# Altium schematic sheet HamsterBear_Core_Board.SchDoc
size A3
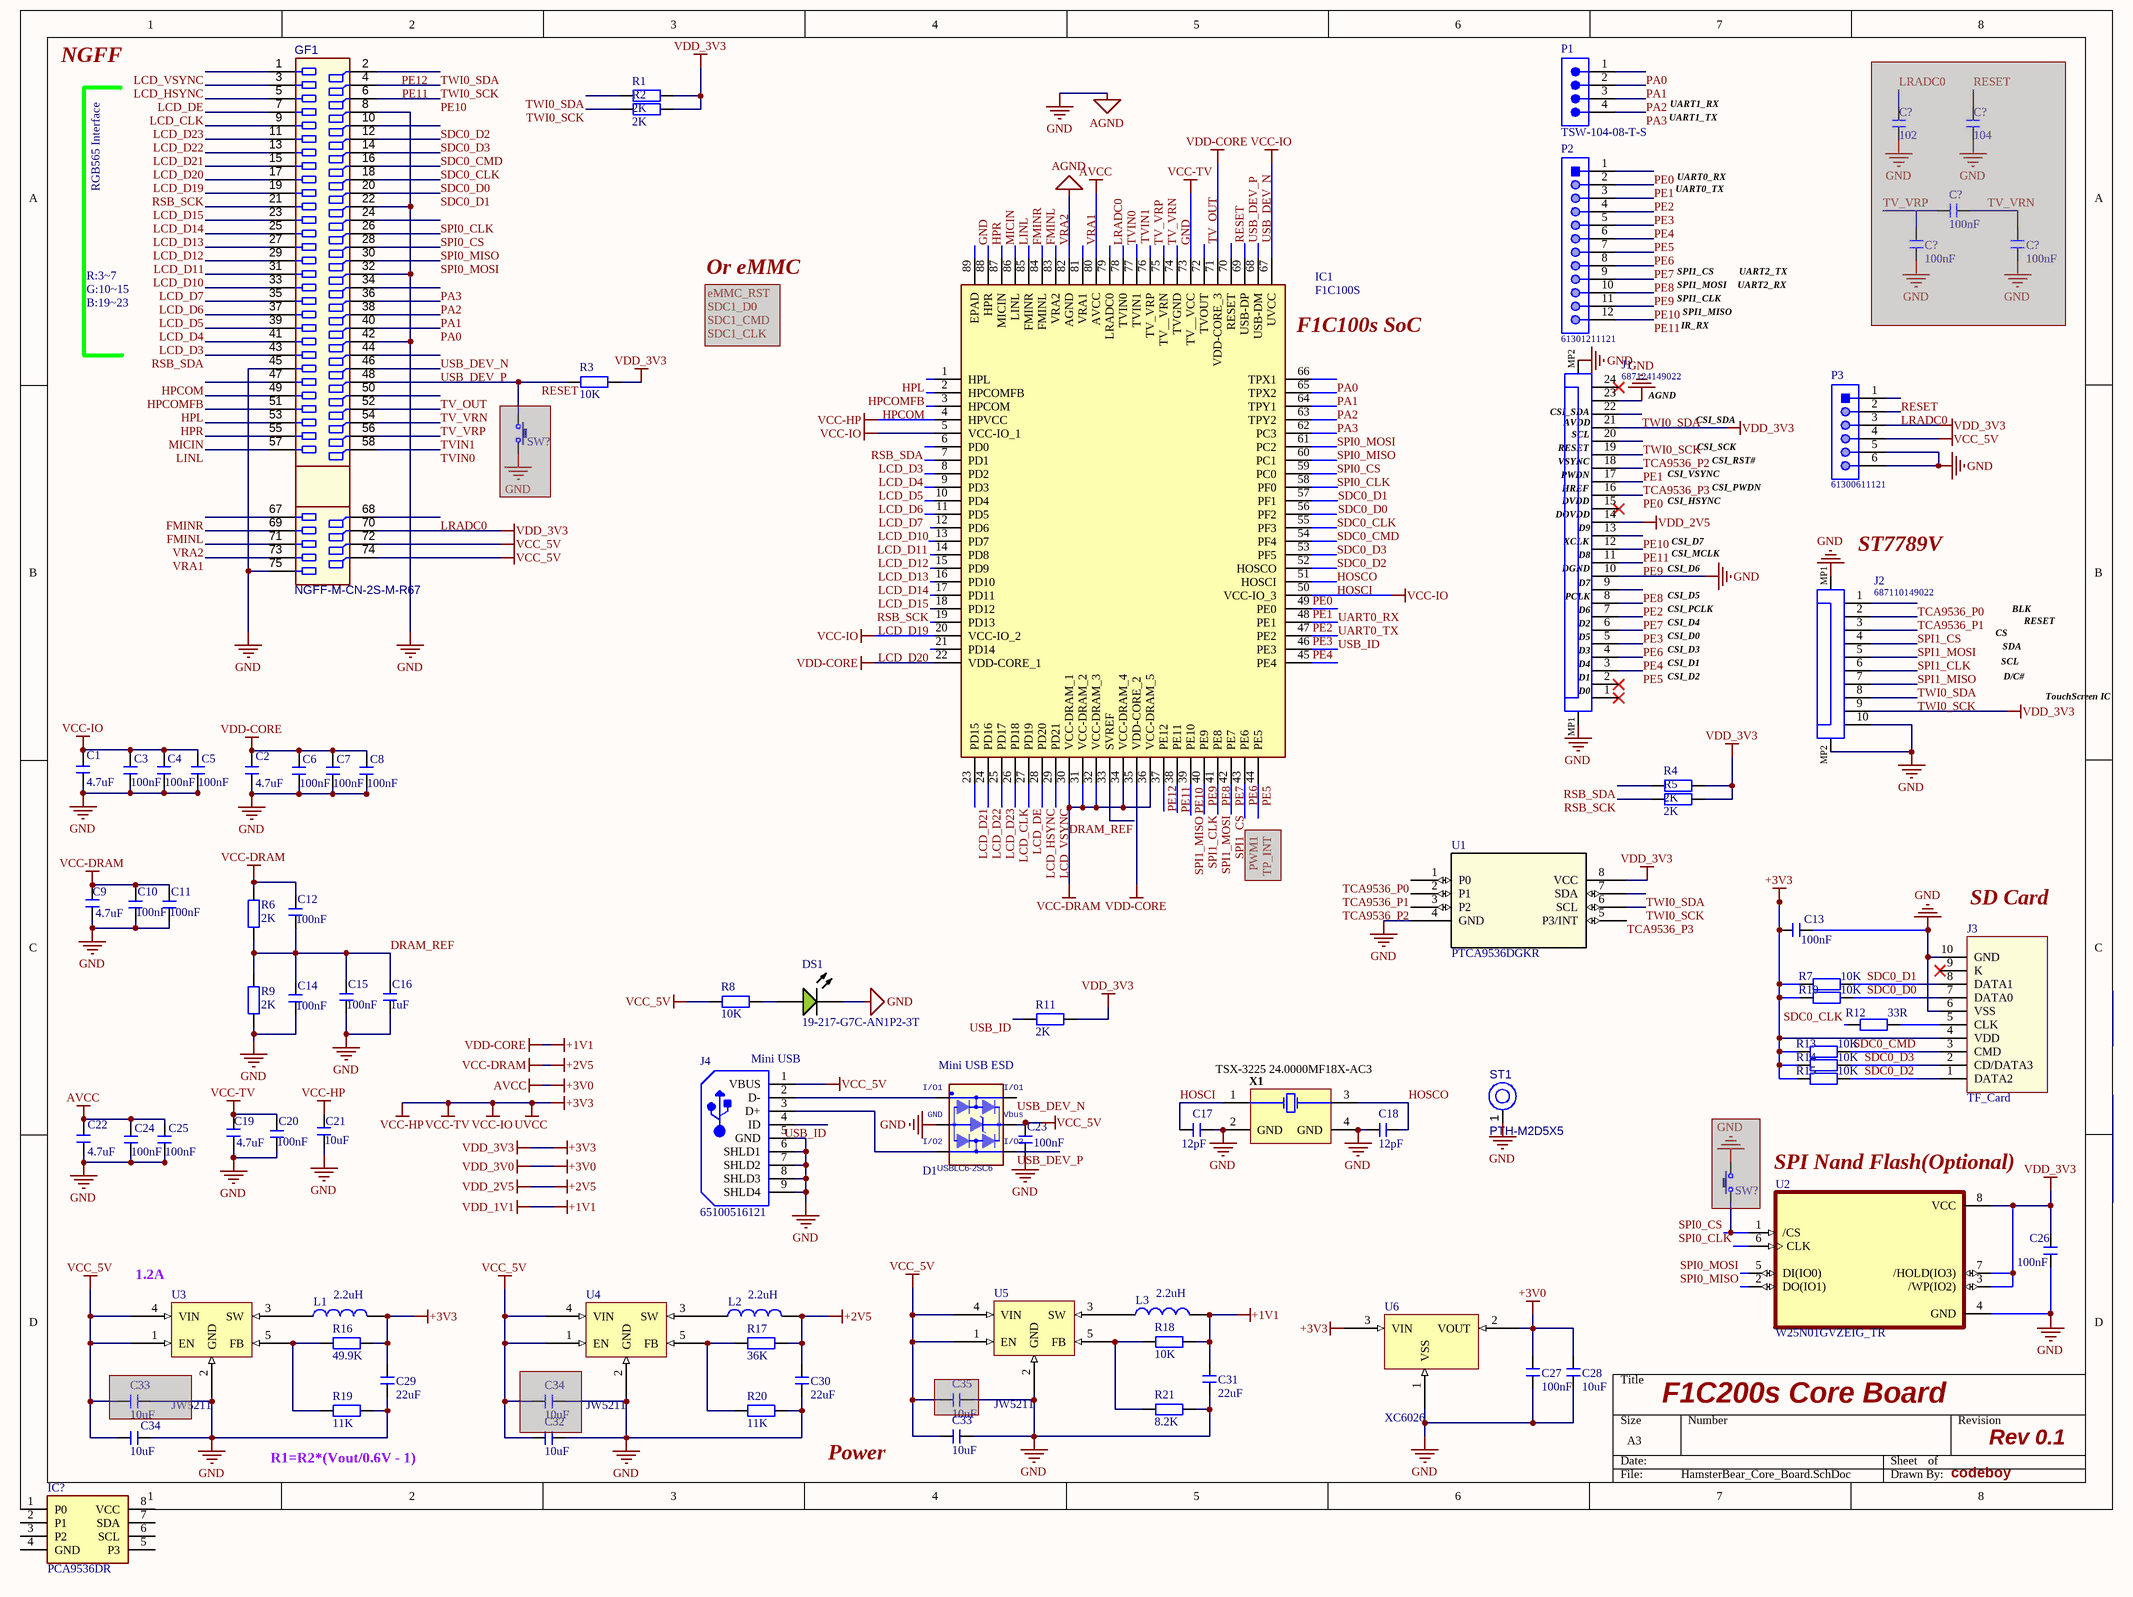
[diagram p0: HamsterBear_Core_Board.SchDoc]

## Parts
(Parts that share a designator on the sheet are numbered #1, #2 ... from top to bottom, then left to right.)
C1  4.7uF  [0603_C]
C2  4.7uF  [0603_C]
C3  100nF  [0603_C]
C4  100nF  [0603_C]
C5  100nF  [0603_C]
C6  100nF  [0603_C]
C7  100nF  [0603_C]
C8  100nF  [0603_C]
C9  4.7uF  [0603_C]
C10  100nF  [0603_C]
C11  100nF  [0603_C]
C12  100nF  [0603_C]
C13  100nF  [0603_C]
C14  100nF  [0603_C]
C15  100nF  [0603_C]
C16  1uF  [0603_C]
C17  12pF  [0603_C]
C18  12pF  [0603_C]
C19  4.7uF  [0603_C]
C20  100nF  [0603_C]
C21  10uF  [0603_C]
C22  4.7uF  [0603_C]
C23  100nF  [0603_C]
C24  100nF  [0603_C]
C25  100nF  [0603_C]
C26  100nF  [0603_C]
C27  100nF  [0603_C]
C28  10uF  [0603_C]
C29  22uF  [0603_C]
C30  22uF  [0603_C]
C31  22uF  [0603_C]
C32  10uF  [0603_C]
C33#1  10uF  [0603_C]  (masked out: inside a compile mask, not in the netlist)
C33#2  10uF  [0603_C]
C34#1  10uF  [0603_C]  (masked out: inside a compile mask, not in the netlist)
C34#2  10uF  [0603_C]
C35  10uF  [0603_C]  (masked out: inside a compile mask, not in the netlist)
C?#1  102  [0603_C]  (masked out: inside a compile mask, not in the netlist)
C?#2  104  [0603_C]  (masked out: inside a compile mask, not in the netlist)
C?#3  100nF  [0603_C]  (masked out: inside a compile mask, not in the netlist)
C?#4  100nF  [0603_C]  (masked out: inside a compile mask, not in the netlist)
C?#5  100nF  [0603_C]  (masked out: inside a compile mask, not in the netlist)
D1  USBLC6-2SC6  [ST_SOT23-6L]
DS1  19-217-G7C-AN1P2-3T  [EVRL-0603-2_V]
GF1  NGFF-M-CN-2S-M-R67  [NGFF-M-GF-2D-500-1K-S67]  (no BOM)
IC1  F1C100S  [QFN40P1000X1000X90_HS-89N]
IC?  PCA9536DR  [SOIC127P600X175-8N]
J1  687124149022  [687124149022]
J2  687110149022  [687110149022]
J3  TF_Card  [TF-SMD_TF-01A]
J4  65100516121  [WE-65100516121_V]
L1  2.2uH  [0805_L]
L2  2.2uH  [0805_L]
L3  2.2uH  [0805_L]
P1  TSW-104-08-T-S  [SMTC-TSW-104-08-X-S]
P2  61301211121  [61301211121]
P3  61300611121  [61300611121]
R1  2K  [0603_R]
R2  2K  [0603_R]
R3  10K  [0603_R]
R4  2K  [0603_R]
R5  2K  [0603_R]
R6  2K  [0603_R]
R7  10K  [0603_R]
R8  10K  [0603_R]
R9  2K  [0603_R]
R10  10K  [0603_R]
R11  2K  [0603_R]
R12  33R  [0603_R]
R13  10K  [0603_R]
R14  10K  [0603_R]
R15  10K  [0603_R]
R16  49.9K  [0603_R]
R17  36K  [0603_R]
R18  10K  [0603_R]
R19  11K  [0603_R]
R20  11K  [0603_R]
R21  8.2K  [0603_R]
ST1  PTH-M2D5X5  [PTH-M2D5X5]
SW?#1  3x4  (value not drawn)  (masked out: inside a compile mask, not in the netlist)
SW?#2  3x4  (value not drawn)  (masked out: inside a compile mask, not in the netlist)
U1  PTCA9536DGKR  [U_VSSOP_DGK_TEX]
U2  W25N01GVZEIG_TR  [WSON8_8x6mm]
U3  JW5211  [SOT-23-5]
U4  JW5211  [SOT-23-5]
U5  JW5211  [SOT-23-5]
U6  XC6026  [SOT95P290X120-3N]
X1  TSX-3225 24.0000MF18X-AC3  [EPSON-TSX-3225_V]

## Nets
+1V1: C2.2 C6.2 C7.2 C8.2 C31.2 IC1.22(VDD-CORE_1) IC1.35(VDD-CORE_2) IC1.71(VDD-CORE_3) L3.2 R18.1  [also labelled VDD-CORE, VDD_1V1]
+2V5: C9.2 C10.2 C11.2 C12.2 C30.2 IC1.30(VCC-DRAM_1) IC1.31(VCC-DRAM_2) IC1.32(VCC-DRAM_3) IC1.34(VCC-DRAM_4) IC1.36(VCC-DRAM_5) J1.14 L2.2 R6.2 R17.1  [also labelled VCC-DRAM, VDD_2V5]
+3V0: C22.2 C24.2 C25.2 C27.1 C28.1 IC1.80(AVCC) U6.2(VOUT)  [also labelled AVCC, VDD_3V0]
+3V3: C1.2 C3.2 C4.2 C5.2 C13.1 C19.2 C20.2 C21.2 C26.2 C29.2 GF1.70 IC1.4(HPVCC) IC1.5(VCC-IO_1) IC1.20(VCC-IO_2) IC1.50(VCC-IO_3) IC1.67(UVCC) IC1.73(TV__VCC) J1.21 J2.9 J3.4(VDD) L1.2 P3.3 R1.2 R2.2 R3.1 R4.2 R5.2 R7.1 R10.1 R11.2 R13.1 R14.1 R15.1 R16.1 U1.8(VCC) U2.3(/WP(IO2)) U2.7(/HOLD(IO3)) U2.8(VCC) U6.3(VIN)  [also labelled UVCC, VCC-HP, VCC-IO, VCC-TV, VDD_3V3]
GND: C1.1 C2.1 C3.1 C4.1 C5.1 C6.1 C7.1 C8.1 C9.1 C10.1 C11.1 C13.2 C14.1 C15.1 C16.1 C17.1 C18.2 C19.1 C20.1 C21.1 C22.1 C23.1 C24.1 C25.1 C26.1 C27.2 C28.2 C29.1 C30.1 C31.1 C32.2 C33#2.2 C34#2.2 D1.2(GND) DS1.2(K) GF1.8 GF1.22 GF1.32 GF1.42 GF1.45 GF1.75 IC1.74(TVGND) IC1.82(AGND) IC1.89(EPAD) J1.10 J1.23 J1.MP1 J1.MP2 J2.10 J2.MP1 J2.MP2 J3.6(VSS) J3.10(GND) J4.5(GND) J4.6(SHLD1) J4.7(SHLD2) J4.8(SHLD3) J4.9(SHLD4) P3.5 P3.6 R9.2 R19.1 R20.1 R21.1 ST1.1(H1) U1.4(GND) U2.4(GND) U3.2(GND) U4.2(GND) U5.2(GND) U6.1(VSS) X1.2(GND) X1.4(GND)  [also labelled AGND]
VCC_5V: C23.2 C32.1 C33#2.1 C34#2.1 D1.5(Vbus) GF1.72 GF1.74 J4.1(VBUS) P3.4 R8.2 U3.1(EN) U3.4(VIN) U4.1(EN) U4.4(VIN) U5.1(EN) U5.4(VIN)
DRAM_REF: C12.1 C14.2 C15.2 C16.2 IC1.33(SVREF) R6.1 R9.1
FMINL: GF1.69 IC1.84(FMINL)
FMINR: GF1.67 IC1.85(FMINR)
HOSCI: C17.2 IC1.51(HOSCI) X1.1(X1)
HOSCO: C18.1 IC1.52(HOSCO) X1.3(X2)
HPCOM: GF1.47 IC1.3(HPCOM)
HPCOMFB: GF1.49 IC1.2(HPCOMFB)
HPL: GF1.51 IC1.1(HPL)
HPR: GF1.53 IC1.88(HPR)
LCD_CLK: GF1.7 IC1.26(PD18)
LCD_D3: GF1.41 IC1.7(PD1)
LCD_D4: GF1.39 IC1.8(PD2)
LCD_D5: GF1.37 IC1.9(PD3)
LCD_D6: GF1.35 IC1.10(PD4)
LCD_D7: GF1.33 IC1.11(PD5)
LCD_D10: GF1.31 IC1.12(PD6)
LCD_D11: GF1.29 IC1.13(PD7)
LCD_D12: GF1.27 IC1.14(PD8)
LCD_D13: GF1.25 IC1.15(PD9)
LCD_D14: GF1.23 IC1.16(PD10)
LCD_D15: GF1.21 IC1.17(PD11)
LCD_D19: GF1.17 IC1.19(PD13)
LCD_D20: GF1.15 IC1.21(PD14)
LCD_D21: GF1.13 IC1.23(PD15)
LCD_D22: GF1.11 IC1.24(PD16)
LCD_D23: GF1.9 IC1.25(PD17)
LCD_DE: GF1.5 IC1.27(PD19)
LCD_HSYNC: GF1.3 IC1.28(PD20)
LCD_VSYNC: GF1.1 IC1.29(PD21)
LINL: GF1.57 IC1.86(LINL)
LRADC0: GF1.68 IC1.79(LRADC0) P3.2
MICIN: GF1.55 IC1.87(MICIN)
PA0: GF1.40 IC1.66(TPX1) P1.1
PA1: GF1.38 IC1.65(TPX2) P1.2
PA2: GF1.36 IC1.64(TPY1) P1.3
PA3: GF1.34 IC1.63(TPY2) P1.4
PE0: IC1.49(PE0) J1.16 P2.1  [also labelled UART0_RX]
PE1: IC1.48(PE1) J1.18 P2.2  [also labelled UART0_TX]
PE2: IC1.47(PE2) J1.8 J4.4(ID) P2.3 R11.1  [also labelled USB_ID]
PE3: IC1.46(PE3) J1.6 P2.4
PE4: IC1.45(PE4) J1.4 P2.5
PE5: IC1.44(PE5) J1.3 P2.6
PE6: IC1.43(PE6) J1.5 P2.7
PE7: IC1.42(PE7) J1.7 J2.3 P2.8  [also labelled SPI1_CS]
PE8: IC1.41(PE8) J1.9 J2.4 P2.9  [also labelled SPI1_MOSI]
PE9: IC1.40(PE9) J1.11 J2.5 P2.10  [also labelled SPI1_CLK]
PE10: GF1.6 IC1.39(PE10) J1.13 J2.6 P2.11  [also labelled SPI1_MISO]
PE11: GF1.4 IC1.38(PE11) J1.12 J1.20 J2.8 P2.12 R2.1 U1.6(SCL)  [also labelled TWI0_SCK]
PE12: GF1.2 IC1.37(PE12) J1.22 J2.7 R1.1 U1.7(SDA)  [also labelled TWI0_SDA]
RESET: GF1.48 IC1.70(RESET) P3.1 R3.2
RSB_SCK: GF1.19 IC1.18(PD12) R5.1
RSB_SDA: GF1.43 IC1.6(PD0) R4.1
SDC0_CLK: GF1.16 IC1.56(PF2) R12.1
SDC0_CMD: GF1.14 IC1.55(PF3) J3.3(CMD) R13.2
SDC0_D0: GF1.18 IC1.57(PF1) J3.7(DATA0) R10.2
SDC0_D1: GF1.20 IC1.58(PF0) J3.8(DATA1) R7.2
SDC0_D2: GF1.10 IC1.53(PF5) J3.1(DATA2) R15.2
SDC0_D3: GF1.12 IC1.54(PF4) J3.2(CD/DATA3) R14.2
SPI0_CLK: GF1.24 IC1.59(PC0) U2.6(CLK)
SPI0_CS: GF1.26 IC1.60(PC1) U2.1(/CS)
SPI0_MISO: GF1.28 IC1.61(PC2) U2.2(DO(IO1))
SPI0_MOSI: GF1.30 IC1.62(PC3) U2.5(DI(IO0))
TCA9536_P0: J2.1 U1.1(P0)
TCA9536_P1: J2.2 U1.2(P1)
TCA9536_P2: J1.19 U1.3(P2)
TCA9536_P3: J1.17 U1.5(P3/INT)
TV_OUT: GF1.50 IC1.72(TVOUT)
TV_VRN: GF1.52 IC1.75(TV__VRN)
TV_VRP: GF1.54 IC1.76(TV_VRP)
TVIN0: GF1.58 IC1.78(TVIN0)
TVIN1: GF1.56 IC1.77(TVIN1)
USB_DEV_N: D1.6(I/O1+) GF1.44 IC1.68(USB-DM)
USB_DEV_P: D1.4(I/O2+) GF1.46 IC1.69(USB-DP)
VRA1: GF1.73 IC1.81(VRA1)
VRA2: GF1.71 IC1.83(VRA2)
NetD1_1: D1.1(I/O1) J4.2(D-)
NetD1_3: D1.3(I/O2) J4.3(D+)
NetDS1_1: DS1.1(A) R8.1
NetJ3_5: J3.5(CLK) R12.2
NetL1_1: L1.1 U3.3(SW)
NetL2_1: L2.1 U4.3(SW)
NetL3_1: L3.1 U5.3(SW)
NetR16_2: R16.2 R19.2 U3.5(FB)
NetR17_2: R17.2 R20.2 U4.5(FB)
NetR18_2: R18.2 R21.2 U5.5(FB)

Not connected (* = marked no-connect by the designer): IC? 1(P0) 2(P1) 3(P2) 4(GND) 5(P3) 6(SCL) 7(SDA) 8(VCC); J1 1* 2* 15* 24*; J3 9(K)*

## Notes on the sheet
- NGFF
- UART1_TX
- UART1_RX
- RGB565 Interface
- UART0_RX
- UART0_TX
- R:3~7
- G:10~15
- B:19~23
- Or eMMC
- SPI1_CS
- SPI1_MOSI
- SPI1_CLK
- SPI1_MISO
- UART2_RX
- UART2_TX
- (near IC1) F1C100s SoC
- IR_RX
- (near J1) CSI_SDA
- (near J1) RESET
- (near J1) AVDD
- (near J1) SCL
- AGND
- CSI_SDA
- CSI_SCK
- (near J1) DOVDD
- (near J1) VSYNC
- (near J1) PWDN
- (near J1) HREF
- (near J1) DVDD
- CSI_VSYNC
- CSI_HSYNC
- CSI_RST#
- CSI_PWDN
- (near J1) DGND
- (near J1) XCLK
- (near J1) D9
- (near J1) D7
- (near J1) D8
- CSI_D6
- CSI_D7
- CSI_MCLK
- (near J2) ST7789V
- (near J1) PCLK
- (near J1) D3
- (near J1) D5
- (near J1) D2
- (near J1) D6
- CSI_D5
- CSI_PCLK
- CSI_D4
- CSI_D0
- CSI_D3
- CS
- SDA
- BLK
- RESET
- (near J1) D0
- (near J1) D1
- (near J1) D4
- CSI_D1
- CSI_D2
- SCL
- D/C#
- TouchScreen IC
- (near J3) SD Card
- (near J4) Mini USB
- (near D1) Mini USB ESD
- SPI Nand Flash(Optional)
- (near U3) 1.2A
- (near R19) R1=R2*(Vout/0.6V - 1)
- Power
- F1C200s Core Board
- Rev 0.1
- codeboy

## Library data of the parts
C1-C32 C33#1 C33#2 C34#1 C34#2 C35 C?#1-C?#5 = C: 无极性贴片电容; 版权归属: 源创客; BOM名称: 无极性贴片电容; 学习资源: www.ooocke.com
DS1 = CMP-007-00002-1: Chip LED, Yellow-Green, 5 V, 25 mA, -40 to 85 degC, 2-Pin SMD (0603), RoHS, Tape and Reel; Manufacturer: Everlight Electronics; Lens Style: Clear; Colour: Green; Viewing Angle: 120degrees; Forward Voltage: 2V; Case/Package: 0603; Mounting Technology: SM; RoHS Compliant: True; Datasheet URL: https://datasheet.ciiva.com/48679/19-217-g7c-an1p2-3t-48679179.pdf; Manufacturer URL: http://www.everlight.com/; Datasheet Version: Rev. 1, 04/2006; Package Description: 2-Pin Surface Mount Device, Body 1.6 x 0.8 mm; Package Reference: 0603; Pins: 2
GF1 = CMP-002-00069-2: Golden finger, NGFF key M, Dual, Staggered, Pitch 0.5mm, 67-Position; Pins: 67
IC1 = F1C100S: Integrated Circuit; Manufacturer_Name: Allwinner Technology; Datasheet Link: https://linux-sunxi.org/images/b/ba/F1C100s_Datasheet_V1.0.pdf; Height: 0.9mm; Manufacturer_Part_Number: F1C100S
IC? = PCA9536DR: Integrated Circuit; Manufacturer_Name: Texas Instruments; Datasheet Link: http://www.ti.com/lit/gpn/pca9536; Height: 1.75mm; Manufacturer_Part_Number: PCA9536DR; Mouser Part Number: 595-PCA9536DR; Mouser Price/Stock: https://www.mouser.co.uk/ProductDetail/Texas-Instruments/PCA9536DR?qs=aEuGZpxfbxUrMrsVTt7%252BhA%3D%3D; Arrow Part Number: PCA9536DR; Arrow Price/Stock: https://www.arrow.com/en/products/pca9536dr/texas-instruments?region=nac
J1 = CMP-1502-01633-1: SMT ZIF Connectors Hinge Type WR-FPC, Horizontal, Bottom Contact, pitch 0.5 mm, 24 pins; Manufacturer: Wurth Elektronik; Rated Current: 0.5A; Withstanding Voltage: 150VAC; Working Voltage: 50VAC; Pitch: 0.5mm; Contact Resistance: 50mOhm; Pin Number: 24; Operating Temperature: -40to105degC; Orientation: Horizontal; Mounting Technology: SMT; Package Reference: 687124149022; Contact Design: BottomContact; Datasheet URL: https://katalog.we-online.de/em/datasheet/687124149022.pdf; Packaging: TapeandReel; Part Number: 687124149022; Publisher: WurthElektronik; Manufacturer URL: http://www.we-online.de
J2 = CMP-1502-01625-1: SMT ZIF Connectors Hinge Type WR-FPC, Horizontal, Bottom Contact, pitch 0.5 mm, 10 pins; Manufacturer: Wurth Elektronik; Withstanding Voltage: 150VAC; Pitch: 0.5mm; Contact Resistance: 50mOhm; Working Voltage: 50VAC; Pin Number: 10; Rated Current: 0.5A; Orientation: Horizontal; Publisher: WurthElektronik; Contact Design: BottomContact; Datasheet URL: https://katalog.we-online.de/em/datasheet/687110149022.pdf; Package Reference: 687110149022; Mounting Technology: SMT; Manufacturer URL: http://www.we-online.de; Operating Temperature: -40to105degC; Part Number: 687110149022; Packaging: TapeandReel
J3 = TF_Card: TF卡座; 版权归属: 源创客; BOM名称: TF卡座; 学习资源: www.ooocke.com
J4 = CMP-2000-05576-1: MINI USB 2.0 SMT Type B 5 Contacts, 30 V, -40 to 105 degC, RoHS, Tape and Reel; Manufacturer: Wuerth Elektronik; Package Description: 5-Pin Surface Mount Device, Body 9.6 x 9.25 mm, Pitch 0.8 mm; Mounting Technology: SurfaceMount; Package Reference: 65100516121; Manufacturer URL: https://www.we-online.com/; Datasheet Version: Rev. H, 02/2013; Datasheet URL: https://datasheet.ciiva.com/4598/65100516121-83749-4598775.pdf
L1-L3 = L: 小功率贴片电感; 版权归属: 源创客; BOM名称: 小功率贴片电感; 学习资源: www.ooocke.com
P1 = CMP-1024-00356-1: 0.025" SQ Post Header, Through-hole, Vertical, -55 to 105 degC, 2.54 mm Pitch, 4-Pin, Male, RoHS; Manufacturer: Samtec; Pitch: 2.54 mm; PackageDescription: .025[0.64] SQ. Post Terminal Strip Assembly; ComponentLink2URL: http://www.samtec.com/documents/webfiles/pdf/TSW_TH.PDF; ComponentLink3URL: http://www.samtec.com/documents/webfiles/cpdf/TSW-XXX-XX-XXX-X-XX-XXX-MKT.pdf; PackageVersion: DM, 8/1988; ComponentLink3Description: Package Specification; DatasheetVersion: F-214; Orientation: Vertical; RoHS: True; Mounting Technology: Through-hole; ComponentLink1URL: http://www.samtec.com; PartNumber: TSW-104-08-T-S; ComponentLink1Description: Manufacturer URL; Temperature Range: -55 to 105 degC; ComponentLink2Description: Datasheet; PackageReference: TSW-104-08-X-S
P2 = CMP-1502-01086-1: THT Vertical Pin Header WR-PHD, Pitch 2.54 mm, Single Row, 12 pins; Manufacturer: Wurth Elektronik; Pin Number: 12; Gender: Male; Working Voltage: 250VAC; Rated Current: 3A; Withstanding Voltage: 500VAC; Pitch: 2.54mm; Contact Resistance: 20mOhm; Orientation: Vertical; Package Reference: 61301211121; Packaging: Bag; Operating Temperature: -40to105degC; Mounting Technology: THT; Part Number: 61301211121; Manufacturer URL: http://www.we-online.de; Row Number: Single; Publisher: WurthElektronik; Datasheet URL: https://katalog.we-online.de/em/datasheet/6130xx11121.pdf
P3 = CMP-1502-01070-1: THT Vertical Pin Header WR-PHD, Pitch 2.54 mm, Single Row, 6 pins; Manufacturer: Wurth Elektronik; Gender: Male; Pin Number: 6; Pitch: 2.54mm; Working Voltage: 250VAC; Rated Current: 3A; Withstanding Voltage: 500VAC; Contact Resistance: 20mOhm; Operating Temperature: -40to105degC; Packaging: Bag; Datasheet URL: https://katalog.we-online.de/em/datasheet/6130xx11121.pdf; Package Reference: 61300611121; Mounting Technology: THT; Publisher: WurthElektronik; Part Number: 61300611121; Manufacturer URL: http://www.we-online.de; Row Number: Single; Orientation: Vertical
R1-R21 = R: 贴片电阻; 版权归属: 源创客; BOM名称: 贴片电阻; 学习资源: www.ooocke.com
ST1 = CMP-00028-00004-1: M2 PTH (2.5mm), 5mm pad; Pins: 1
SW?#1 SW?#2 = TSW 3x6: 3x4轻触开关
U1 = PTCA9536DGKR: No Description Available; Mfr_Name: Texas Instruments; Copyright: Copyright (C) 2022 Ultra Librarian. All rights reserved.; Manufacturer_Part_Number: PTCA9536DGKR; RefDes: RefDes; Type: DEV
U2 = W25N01GVZEIG_TR: Ic Flash 1gbit 104mhz 8wson; MF: {'manufacturer': u'Winbond Electronics'}; Package: None; MP: W25N01GVZEIG_TR; Value: *; Availability: Unavailable; Price: None
X1 = CMP-2000-07332-1: MHz Range Crystal Unit, 16 MHz, -40 to 85 degC, 4-Pin SMD, RoHS, Tape and Reel; Manufacturer: Epson; Unit Weight: 0.000564oz; Tolerance: 10PPM; ESR: 60Ohms; Frequency: 16MHz; Drive Level: 200uW; Brand: EpsonTiming; Load Capacitance: 9pF; Product Category: Crystals; Packaging: Reel; Termination Style: SMD/SMT; Width: 2.5mm; Length: 3.2mm; Type: Crystal; Datasheet Version: 12/2015; Factory Pack Quantity: 250; Package Description: 4-Pin Surface Mount Device, Body 3.2 x 2.5 mm; Package / Case: 3.2mmx2.5mm; Mounting Style: SMD/SMT; Series: TSX-3225; Frequency Stability: 10PPM; Package Reference: TSX-3225; Mounting Technology: SurfaceMount; RoHS: True; Height: 0.6mm; Datasheet URL: https://support.epson.biz/td/api/doc_check.php?dl=brief_FA-238V_en.pdf; Operating Temperature Range: -40Cto+85C; Manufacturer URL: https://www.eea.epson.com/